# Altium schematic sheet parero_board_schematic.SchDoc: PARERO DSP BOARD
size A4; ApprovedBy: _conics; CheckedBy: Abdulrahman SJ; CompanyName: PARERO; DrawnBy: Abdulrahman; DocumentNumber: 1; Revision: 0.1; SheetNumber: 1; SheetTotal: 4
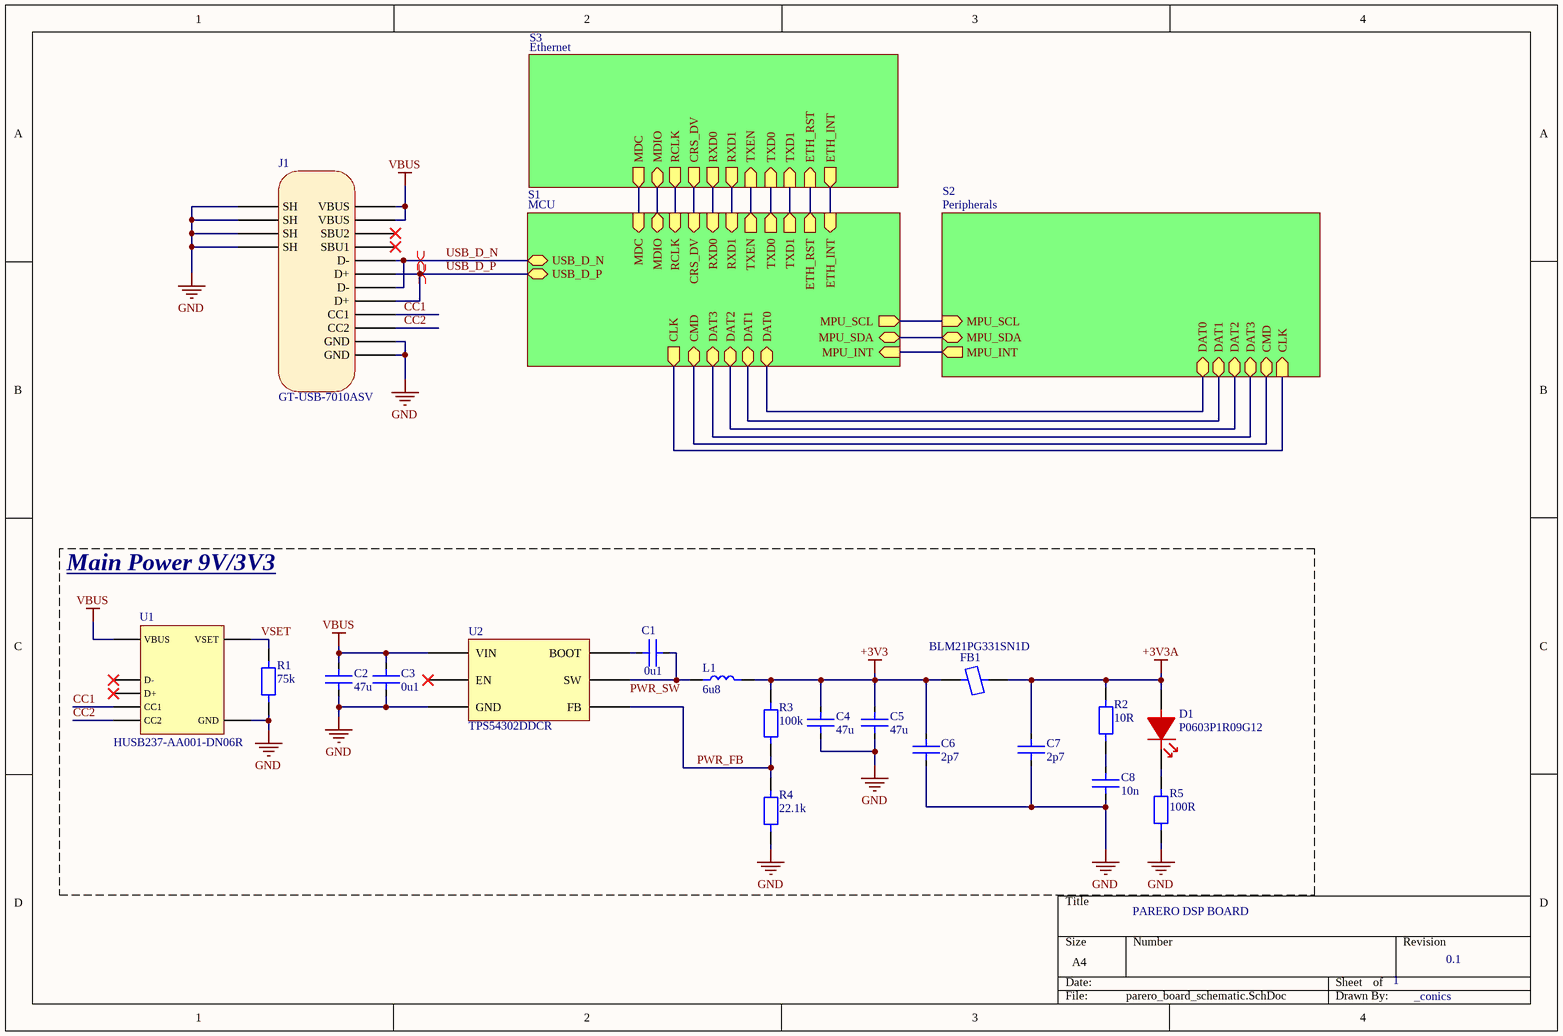
[diagram p0: parero_board_schematic.SchDoc]

## Parts
C1  0u1  [CAP_MLCC_0402]
C2  47u  [CAP_MLCC_1210]
C3  0u1  [CAP_MLCC_0603]
C4  47u  [CAP_MLCC_1210]
C5  47u  [CAP_MLCC_1210]
C6  2p7  [CAP_MLCC_0402]
C7  2p7  [CAP_MLCC_0402]
C8  10n  [CAP_MLCC_0402]
D1  P0603P1R09G12  [LED_0603]
FB1  BLM21PG331SN1D  [FBEAD_0805]
J1  GT-USB-7010ASV  [CONN_CH_USB_SMD_USB]
L1  6u8  [INDM5452X30N]
R1  75k  [RES_SMD_0402]
R2  10R  [RES_SMD_0402]
R3  100k  [RES_SMD_0402]
R4  22.1k  [RES_SMD_0402]
R5  100R  [RES_SMD_0402]
U1  HUSB237-AA001-DN06R  [USB_PD_DFN6]
U2  TPS54302DDCR  [SOT95P280X110-6N]

## Blocks framed on the sheet
Main Power 9V/3V3: C1-C8 D1 FB1 L1 R1-R5 U1 U2

## Sub-sheets
S1 = MCU: MPU_SDA (bidir), MPU_INT (in), MPU_SCL (out), DAT0 (bidir), DAT1 (bidir), DAT2 (bidir), DAT3 (bidir), CMD (bidir), CLK (out), USB_D_P (bidir), USB_D_N (bidir), MDC (in), RCLK (in), MDIO (bidir), CRS_DV (in), RXD0 (in), RXD1 (in), TXD0 (out), TXEN (out), TXD1 (out), ETH_INT (in), ETH_RST (out)
S2 = Peripherals: MPU_SCL (in), MPU_SDA (bidir), MPU_INT (out), CLK (in), CMD (bidir), DAT3 (bidir), DAT2 (bidir), DAT1 (bidir), DAT0 (bidir)
S3 = Ethernet: RXD0 (out), RXD1 (out), TXD0 (in), TXD1 (in), RCLK (out), ETH_INT (out), CRS_DV (out), TXEN (in), MDC (out), MDIO (bidir), ETH_RST (in)

## Nets
+3V3: C4.2 C5.2 C6.2 FB1.2 L1.2 R3.2
+3V3A: C7.2 D1.2 FB1.1 R2.2
GND: C2.1 C3.1 C4.1 C5.1 C6.1 C7.1 C8.1 J1.11(GND) J1.12(GND) J1.13(SH) J1.14(SH) J1.15(SH) J1.16(SH) R1.2 R4.1 R5.1 U1.7(GND) U2.1(GND)
VBUS: C2.2 C3.2 J1.1(VBUS) J1.2(VBUS) U1.2(VBUS) U2.3(VIN)
CC1: J1.4(CC1) U1.1(CC1)
CC2: J1.10(CC2) U1.6(CC2)
PWR_FB: R3.1 R4.2 U2.4(FB)
PWR_SW: C1.1 L1.1 U2.2(SW)
USB_D_N: J1.5(D-) J1.7(D-) ; sheet S1/USB_D_N
USB_D_P: J1.6(D+) J1.8(D+) ; sheet S1/USB_D_P
VSET: R1.1 U1.3(VSET)
NetC1_2: C1.2 U2.6(BOOT)
NetC8_2: C8.2 R2.1
NetD1_1: D1.1 R5.2
(unnamed): sheet S1/MPU_SDA, sheet S2/MPU_SDA
(unnamed): sheet S1/MPU_INT, sheet S2/MPU_INT
(unnamed): sheet S1/MPU_SCL, sheet S2/MPU_SCL
(unnamed): sheet S1/DAT0, sheet S2/DAT0
(unnamed): sheet S1/DAT1, sheet S2/DAT1
(unnamed): sheet S1/DAT2, sheet S2/DAT2
(unnamed): sheet S1/DAT3, sheet S2/DAT3
(unnamed): sheet S1/CMD, sheet S2/CMD
(unnamed): sheet S1/CLK, sheet S2/CLK
(unnamed): sheet S1/MDC, sheet S3/MDC
(unnamed): sheet S1/RCLK, sheet S3/RCLK
(unnamed): sheet S1/MDIO, sheet S3/MDIO
(unnamed): sheet S1/CRS_DV, sheet S3/CRS_DV
(unnamed): sheet S1/RXD0, sheet S3/RXD0
(unnamed): sheet S1/RXD1, sheet S3/RXD1
(unnamed): sheet S1/TXD0, sheet S3/TXD0
(unnamed): sheet S1/TXEN, sheet S3/TXEN
(unnamed): sheet S1/TXD1, sheet S3/TXD1
(unnamed): sheet S1/ETH_INT, sheet S3/ETH_INT
(unnamed): sheet S1/ETH_RST, sheet S3/ETH_RST

Not connected (* = marked no-connect by the designer): J1 3(SBU2)* 9(SBU1)*; U1 4(D+)* 5(D-)*; U2 5(EN)*

## Layout directives
differential pair: USB_D_N, USB_D_P

## Library data of the parts
C1 = Cap MLCC 0402: Multilayer  Ceramic Capacitor; Manufacturer 1: Samsung Electro-Mechanics; Manufacturer Part Number 1: CL05B104KO5NNNC; Designator: C?; Quantity: *
C2 C4 C5 = Cap MLCC 1210: Multilayer  Ceramic Capacitor; Manufacturer 1: muRata; Manufacturer Part Number 1: GRM32EC81C476KE15L; Designator: C?; Quantity: *
C3 = Cap MLCC 0603: Multilayer  Ceramic Capacitor; Manufacturer 1: Samsung Electro-Mechanics; Manufacturer Part Number 1: CL10B104JB8NNNC; Designator: C?; Quantity: *
C6 C7 = Cap MLCC 0402: Multilayer  Ceramic Capacitor; Manufacturer 1: muRata; Manufacturer Part Number 1: GRM1555C1H2R7CA01D; Designator: C?; Quantity: *
C8 = Cap MLCC 0402: Multilayer  Ceramic Capacitor; Manufacturer 1: muRata; Manufacturer Part Number 1: GRM1555C1E103GE01D; Designator: C?; Quantity: *
D1 = Diode LED R: 20mA 350mcd 621nm Red 2V 0603 LED Indication - Discrete ROHS; Manufacturer 1: Silverlight; Designator: D?; Manufacturer Part Number 1: P0603P1R09G12; Quantity: *; ComponentLink1Description: Product Link; ComponentLink1URL: https://www.lcsc.com/product-detail/C5123549.html; ComponentLink2Description: Datasheet; ComponentLink2URL: https://www.lcsc.com/datasheet/C5123549.pdf
FB1 = Filter Ferrite Bead 0805: 70mΩ ±25% 330Ω@100MHz 0805 Ferrite Beads and Chips RoHS; Manufacturer 1: muRata; Designator: FB?; Manufacturer Part Number 1: BLM21PG331SN1D; Quantity: *
J1 = Connector USB-C CH: USB 2.0 1 16P -40℃~+85℃ Type-C SMD USB, DVI, HDMI Connector Assemblies ROHS; Manufacturer 1: G-Switch; Manufacturer Part Number 1: GT-USB-7010ASV; Quantity: *; ComponentLink1Description: Datasheet; ComponentLink1URL: https://atta.szlcsc.com/upload/public/pdf/source/20230327/DF227B64686AC8FA0AD1775797F2C3F1.pdf; ComponentLink2Description: Product Link; ComponentLink2URL: https://www.lcsc.com/product-detail/C2988369.html
L1 = Inductor 6u8 3A SMD 5.4X5.2mm: 6.8uH Molded Inductor 4A SMD,5.4x5.2mm Fixed Inductors RoHS; Manufacturer 1: cjiang; Manufacturer Part Number 1: FXL0530-6R8-M; Designator: L?; Quantity: *; ComponentLink1Description: Datasheet; ComponentLink1URL: https://www.lcsc.com/datasheet/C177249.pdf; ComponentLink2Description: Product Link; ComponentLink2URL: https://www.lcsc.com/product-detail/C177249.html
R1 = Resistor 0402: General Purpose SMD Carbon Resistor; Manufacturer 1: UNI-ROYAL; Manufacturer Part Number 1: 0402WGD7502TCE; Designator: R?; Quantity: *
R2 = Resistor 0402: General Purpose SMD Carbon Resistor; Manufacturer 1: UNI-ROYAL; Manufacturer Part Number 1: 0402WGF100JTCE; Designator: R?; Quantity: *
R3 = Resistor 0402: General Purpose SMD Carbon Resistor; Manufacturer 1: UNI-ROYAL; Manufacturer Part Number 1: 0402WGD1003TCE; Designator: R?; Quantity: *
R4 = Resistor 0402: General Purpose SMD Carbon Resistor; Manufacturer 1: UNI-ROYAL; Manufacturer Part Number 1: 0402WGD2212TCE; Designator: R?; Quantity: *
R5 = Resistor 0402: General Purpose SMD Carbon Resistor; Manufacturer 1: UNI-ROYAL; Manufacturer Part Number 1: 0402WGF1000TCE; Designator: R?; Quantity: *
U1 = PMIC USB-PD 20V/5A: Power Receiver Controller 100W DFN-6L-EP(2x2) Power Management - Specialized RoHS; Manufacturer 1: Hynetek; Manufacturer Part Number 1: HUSB237-AA001-DN06R; Quantity: *; ComponentLink1Description: Datasheet; ComponentLink1URL: https://www.lcsc.com/datasheet/C22373734.pdf; ComponentLink2Description: Product Link; ComponentLink2URL: https://www.lcsc.com/product-detail/C22373734.html
U2 = DC/DC Buck Adj 3A: 400kHz Buck Adjustable 1 TSOT-23-6 Voltage Regulators - DC DC Switching Regulators RoHS; Manufacturer 1: TI; Manufacturer Part Number 1: TPS54302DDCR; Quantity: *; ComponentLink1Description: Datasheet; ComponentLink1URL: https://www.lcsc.com/datasheet/C311983.pdf; ComponentLink2Description: Product Link; ComponentLink2URL: https://www.lcsc.com/product-detail/C311983.html